# EAGLE design ultimate imu-v12 (EAGLE 5.06)

## Sheet 1 of 2
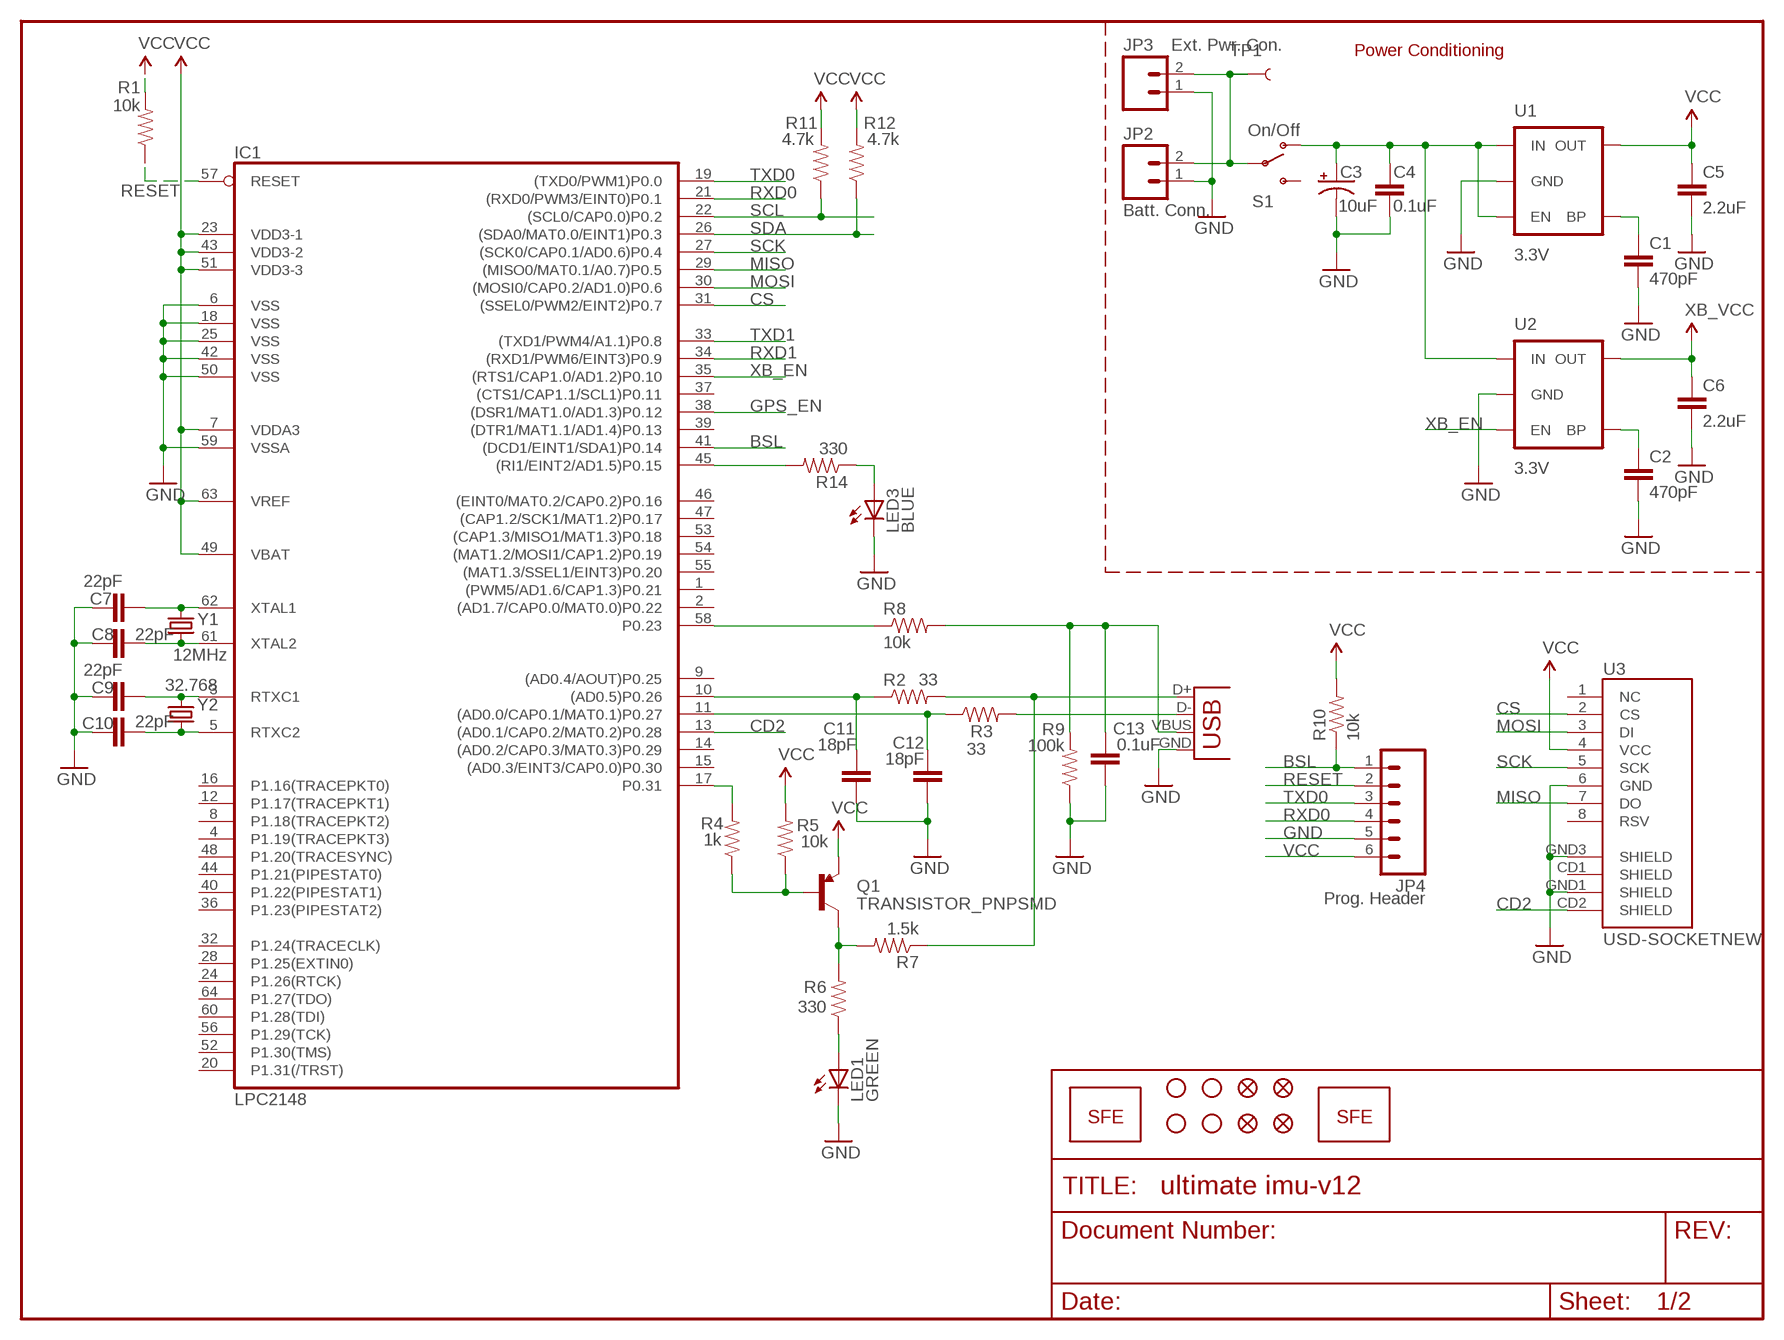
[diagram p0: schematic, sheet 1]

### Parts
C1  470pF  CAP0402-CAP  [0402-CAP]
C2  470pF  CAP0402-CAP  [0402-CAP]
C3  10uF  CAP_POL3528  [EIA3528]
C4  0.1uF  CAP0402-CAP  [0402-CAP]
C5  2.2uF  CAP0402-CAP  [0402-CAP]
C6  2.2uF  CAP0402-CAP  [0402-CAP]
C7  22pF  CAP0402-CAP  [0402-CAP]
C8  22pF  CAP0402-CAP  [0402-CAP]
C9  22pF  CAP0402-CAP  [0402-CAP]
C10  22pF  CAP0402-CAP  [0402-CAP]
C11  18pF  CAP0402-CAP  [0402-CAP]
C12  18pF  CAP0402-CAP  [0402-CAP]
C13  0.1uF  CAP0402-CAP  [0402-CAP]
IC1  LPC2148  LPC213X  [SQFP-S-10X10-64]
JP1  LOGO-SFENEW  [SFE-NEW-WEBLOGO]
JP2  Batt. Conn.  M02-JST-2MM-SMT  [JST-2-SMD]
JP3  Ext. Pwr. Con.  M02PTH  [1X02]
JP4  Prog. Header  M06SIP  [1X06]
JP6  STAND-OFF  [STAND-OFF]
JP7  STAND-OFF  [STAND-OFF]
JP8  STAND-OFF  [STAND-OFF]
JP9  STAND-OFF  [STAND-OFF]
JP10  FIDUCIAL1X2  [FIDUCIAL-1X2]
JP11  FIDUCIAL1X2  [FIDUCIAL-1X2]
JP12  LOGO-SFESK  [SFE-LOGO-FLAME]
JP13  FIDUCIAL1X2  [FIDUCIAL-1X2]
JP14  FIDUCIAL1X2  [FIDUCIAL-1X2]
LED1  GREEN  LED0603  [LED-0603]
LED3  BLUE  LED0603  [LED-0603]
Q1  TRANSISTOR_PNPSMD  [SOT23-3]
R1  10k  RESISTOR0402-RES  [0402-RES]
R2  33  RESISTOR0402-RES  [0402-RES]
R3  33  RESISTOR0402-RES  [0402-RES]
R4  1k  RESISTOR0402-RES  [0402-RES]
R5  10k  RESISTOR0402-RES  [0402-RES]
R6  330  RESISTOR0402-RES  [0402-RES]
R7  1.5k  RESISTOR0402-RES  [0402-RES]
R8  10k  RESISTOR0402-RES  [0402-RES]
R9  100k  RESISTOR0402-RES  [0402-RES]
R10  10k  RESISTOR0402-RES  [0402-RES]
R11  4.7k  RESISTOR0402-RES  [0402-RES]
R12  4.7k  RESISTOR0402-RES  [0402-RES]
R14  330  RESISTOR0402-RES  [0402-RES]
S1  On/Off  SWITCH-SPSTSMD  [AYZ0202]
TP1  TEST-POINT3X5  [PAD.03X.05]
U1  3.3V  V_REG_LDOSMD  [SOT23-5]
U2  3.3V  V_REG_LDOSMD  [SOT23-5]
U3  USD-SOCKETNEW  [MICRO-SD-SOCKET-PP]
X1  USBSMD  [USB-MINIB]
Y1  12MHz  CRYSTAL5X3  [CRYSTAL-SMD-5X3]
Y2  32.768  CRYSTAL32-SMD  [CRYSTAL-32KHZ-SMD]

### Nets
BSL: IC1.41((DCD1/EINT1/SDA1)P0.14) JP4.1 R10.1
CD2: IC1.13((AD0.1/CAP0.2/MAT0.2)P0.28) U3.CD2(SHIELD)
CS: IC1.31((SSEL0/PWM2/EINT2)P0.7) U3.2(CS)
GND: C1.2 C2.2 C3.C(-) C4.2 C5.2 C6.2 C7.1 C8.1 C9.1 C10.1 C11.1 C12.1 C13.1 IC1.6(VSS) IC1.18(VSS) IC1.25(VSS) IC1.42(VSS) IC1.50(VSS) IC1.59(VSSA) JP2.1 JP3.1 JP4.5 LED1.C LED3.C R9.1 U1.2(GND) U2.2(GND) U3.6(GND) U3.GND1(SHIELD) U3.GND3(SHIELD) X1.GND ; also sheet 2
GPS_EN: IC1.38((DSR1/MAT1.0/AD1.3)P0.12) ; also sheet 2
MISO: IC1.29((MISO0/MAT0.1/A0.7)P0.5) U3.7(DO)
MOSI: IC1.30((MOSI0/CAP0.2/AD1.0)P0.6) U3.3(DI)
N$4: C7.2 IC1.62(XTAL1) Y1.3
N$5: IC1.45((RI1/EINT2/AD1.5)P0.15) R14.2
N$6: C1.1 U1.4(BP)
N$7: C2.1 U2.4(BP)
N$8: C8.2 IC1.61(XTAL2) Y1.1
N$9: C9.2 IC1.3(RTXC1) Y2.X1
N$10: C10.2 IC1.5(RTXC2) Y2.X2
N$11: C11.2 IC1.10((AD0.5)P0.26) R2.1
N$12: R2.2 R7.1 X1.D+
N$13: R3.2 X1.D-
N$14: C12.2 IC1.11((AD0.0/CAP0.1/MAT0.1)P0.27) R3.1
N$15: IC1.17(P0.31) R4.2
N$16: Q1.1(B) R4.1 R5.1
N$17: LED3.A R14.1
N$19: Q1.3(C) R6.2 R7.2
N$20: LED1.A R6.1
N$21: IC1.58(P0.23) R8.1
N$22: C13.2 R8.2 R9.2 X1.VBUS
RESET: IC1.57(RESET) JP4.2 R1.1
RXD0: IC1.21((RXD0/PWM3/EINT0)P0.1) JP4.4 ; also sheet 2
RXD1: IC1.34((RXD1/PWM6/EINT3)P0.9) ; also sheet 2
SCK: IC1.27((SCK0/CAP0.1/AD0.6)P0.4) U3.5(SCK)
SCL: IC1.22((SCL0/CAP0.0)P0.2) R11.1 ; also sheet 2
SDA: IC1.26((SDA0/MAT0.0/EINT1)P0.3) R12.1 ; also sheet 2
TXD0: IC1.19((TXD0/PWM1)P0.0) JP4.3 ; also sheet 2
TXD1: IC1.33((TXD1/PWM4/A1.1)P0.8) ; also sheet 2
VBAT: JP2.2 JP3.2 S1.2(P) TP1.P$1
VCC: C5.1 IC1.7(VDDA3) IC1.23(VDD3-1) IC1.43(VDD3-2) IC1.49(VBAT) IC1.51(VDD3-3) IC1.63(VREF) JP4.6 Q1.2(E) R1.2 R5.2 R10.2 R11.2 R12.2 U1.5(OUT) U3.4(VCC) ; also sheet 2
VON: C3.A(+) C4.1 S1.1(O) U1.1(IN) U1.3(EN) U2.1(IN)
XB_EN: IC1.35((RTS1/CAP1.0/AD1.2)P0.10) U2.3(EN)
XB_VCC: C6.1 U2.5(OUT) ; also sheet 2
Unconnected: IC1.1((PWM5/AD1.6/CAP1.3)P0.21) IC1.2((AD1.7/CAP0.0/MAT0.0)P0.22) IC1.4(P1.19(TRACEPKT3)) IC1.8(P1.18(TRACEPKT2)) IC1.9((AD0.4/AOUT)P0.25) IC1.12(P1.17(TRACEPKT1)) IC1.14((AD0.2/CAP0.3/MAT0.3)P0.29) IC1.15((AD0.3/EINT3/CAP0.0)P0.30) IC1.16(P1.16(TRACEPKT0)) IC1.20(P1.31(/TRST)) IC1.24(P1.26(RTCK)) IC1.28(P1.25(EXTIN0)) IC1.32(P1.24(TRACECLK)) IC1.36(P1.23(PIPESTAT2)) IC1.37((CTS1/CAP1.1/SCL1)P0.11) IC1.39((DTR1/MAT1.1/AD1.4)P0.13) IC1.40(P1.22(PIPESTAT1)) IC1.44(P1.21(PIPESTAT0)) IC1.46((EINT0/MAT0.2/CAP0.2)P0.16) IC1.47((CAP1.2/SCK1/MAT1.2)P0.17) IC1.48(P1.20(TRACESYNC)) IC1.52(P1.30(TMS)) IC1.53((CAP1.3/MISO1/MAT1.3)P0.18) IC1.54((MAT1.2/MOSI1/CAP1.2)P0.19) IC1.55((MAT1.3/SSEL1/EINT3)P0.20) IC1.56(P1.29(TCK)) IC1.60(P1.28(TDI)) IC1.64(P1.27(TDO)) S1.3(S) U3.1(NC) U3.8(RSV) U3.CD1(SHIELD)

### Notes on the sheet
- Power Conditioning

## Sheet 2 of 2
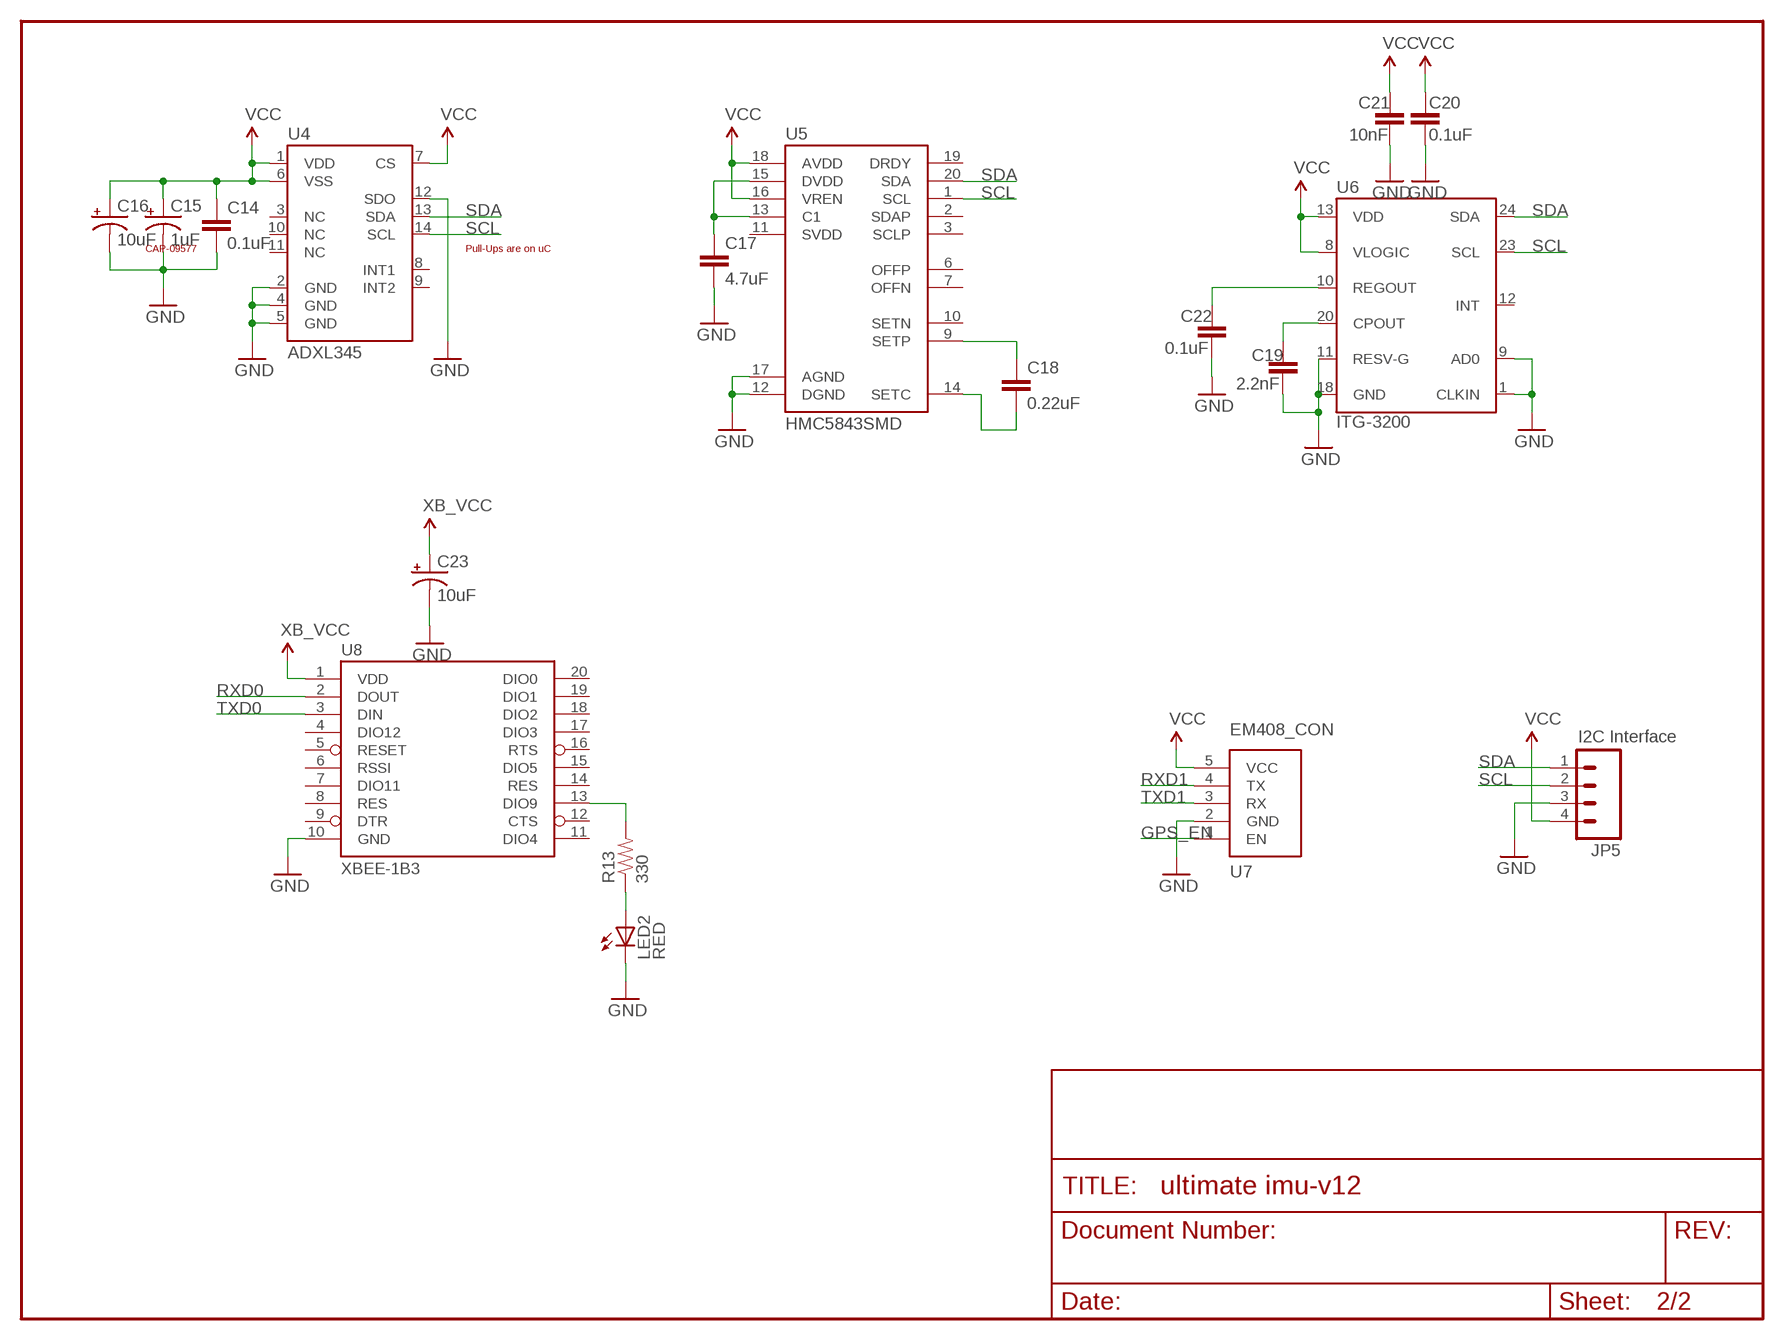
[diagram p1: schematic, sheet 2]

### Parts
C14  0.1uF  CAP0402-CAP  [0402-CAP]
C15  1uF  CAP_POLC  [PANASONIC_C]
C16  10uF  CAP_POL3528  [EIA3528]
C17  4.7uF  CAP0402-CAP  [0402-CAP]
C18  0.22uF  CAP0402-CAP  [0402-CAP]
C19  2.2nF  CAP0402-CAP  [0402-CAP]
C20  0.1uF  CAP0402-CAP  [0402-CAP]
C21  10nF  CAP0402-CAP  [0402-CAP]
C22  0.1uF  CAP0402-CAP  [0402-CAP]
C23  10uF  CAP_POL1206  [EIA3216]
JP5  I2C Interface  M04PTH  [1X04]
LED2  RED  LED0603  [LED-0603]
R13  330  RESISTOR0402-RES  [0402-RES]
U4  ADXL345  [LGA14]
U5  HMC5843SMD  [LPCC20]
U6  ITG-3200  [QFN-24]
U7  EM408_CON  [EM408_CON]
U8  XBEE-1B3  [XBEE-SMD]

### Nets
GND: C14.2 C15.- C16.C(-) C17.2 C19.2 C20.2 C21.2 C22.2 C23.C(-) JP5.3 LED2.C U4.2(GND) U4.4(GND) U4.5(GND) U4.12(SDO) U5.12(DGND) U5.17(AGND) U6.1(CLKIN) U6.9(AD0) U6.11(RESV-G) U6.18(GND) U7.2(GND) U8.10(GND) ; also sheet 1
GPS_EN: U7.1(EN) ; also sheet 1
N$1: C19.1 U6.20(CPOUT)
N$2: C18.2 U5.14(SETC)
N$3: C18.1 U5.9(SETP)
N$24: C17.1 U5.13(C1) U5.15(DVDD)
N$25: LED2.A R13.1
N$26: C22.1 U6.10(REGOUT)
N$28: R13.2 U8.13(DIO9)
RXD0: U8.2(DOUT) ; also sheet 1
RXD1: U7.4(TX) ; also sheet 1
SCL: JP5.2 U4.14(SCL) U5.1(SCL) U6.23(SCL) ; also sheet 1
SDA: JP5.1 U4.13(SDA) U5.20(SDA) U6.24(SDA) ; also sheet 1
TXD0: U8.3(DIN) ; also sheet 1
TXD1: U7.3(RX) ; also sheet 1
VCC: C14.1 C15.+ C16.A(+) C20.1 C21.1 JP5.4 U4.1(VDD) U4.6(VSS) U4.7(CS) U5.16(VREN) U5.18(AVDD) U6.8(VLOGIC) U6.13(VDD) U7.5(VCC) ; also sheet 1
XB_VCC: C23.A(+) U8.1(VDD) ; also sheet 1
Unconnected: U4.3(NC) U4.8(INT1) U4.9(INT2) U4.10(NC) U4.11(NC) U5.2(SDAP) U5.3(SCLP) U5.6(OFFP) U5.7(OFFN) U5.10(SETN) U5.11(SVDD) U5.19(DRDY) U6.12(INT) U8.4(DIO12) U8.5(RESET) U8.6(RSSI) U8.7(DIO11) U8.8(RES) U8.9(DTR) U8.11(DIO4) U8.12(CTS) U8.14(RES) U8.15(DIO5) U8.16(RTS) U8.17(DIO3) U8.18(DIO2) U8.19(DIO1) U8.20(DIO0)

### Notes on the sheet
- CAP-09577 | Pull-Ups are on uC

## Library data of the parts
C1 C2 C4-C14 C17-C22 = SparkFun:CAP: Capacitor Standard 0603 ceramic capacitor, and 0.1" leaded capacitor.
C3 C15 C16 C23 = SparkFun:CAP_POL: Capacitor Polarized These are standard SMD and PTH capacitors. Normally 10uF, 47uF, and 100uF in electrolytic and tantalum varieties. Always verify the external diameter of the through hole cap, it varies with capacity, voltage, and manufacturer. The EIA devices should be standard.
IC1 = SparkFun:LPC213X: LPC213x Schematic element and footprint for NXP LPC213x. Spark Fun Electronics SKU : COM-00520
JP1 JP12 = SparkFun:LOGO-SFE: Spark Fun Electronics PCB Logo This is the standard Spark Fun Electronics PCB logo.
JP2 JP3 = SparkFun:M02: Header 2 Standard 2-pin 0.1" header. Use with straight break away headers (SKU : PRT-00116), right angle break away headers (PRT-00553), swiss pins (PRT-00743), machine pins (PRT-00117), and female headers (PRT-00115). Molex polarized connector foot print use with SKU : PRT-08233 with associated crimp pins and housings.
JP4 = SparkFun:M06: Header 6 Standard 6-pin 0.1" header. Use with straight break away headers (SKU : PRT-00116), right angle break away headers (PRT-00553), swiss pins (PRT-00743), machine pins (PRT-00117), and female headers (PRT-00115). Molex polarized connector foot print use with SKU : PRT-08094 with associated crimp pins and housings. NOTES ON THE VARIANTS LOCK and LOCK_LONGPADS... This footprint was designed to help hold the alignment of a through-hole component (i.e. 6-pin header) while soldering it into place. You may notice that each hole has been shifted either up or down by 0.005 of an inch from it's more standard position (which is a perfectly straight line). This slight alteration caused the pins (the squares in the middle) to touch the edges of the holes. Because they are alternating, it causes a "brace" to hold the component in place. 0.005 has proven to be the perfect amount of "off-center" position when using our standard breakaway headers. Although looks a little odd when you look at the bare footprint, once you have a header in there, the alteration is very hard to notice. Also, if you push a header all the way into place, it is covered up entirely on the bottom side. This idea of altering the position of holes to aid alignment will be further integrated into the Sparkfun Library for other footprints. It can help hold any component with 3 or more connection pins.
JP5 = SparkFun:M04: Header 4 Standard 4-pin 0.1" header. Use with straight break away headers (SKU : PRT-00116), right angle break away headers (PRT-00553), swiss pins (PRT-00743), machine pins (PRT-00117), and female headers (PRT-00115). Molex polarized connector foot print use with SKU : PRT-08231 with associated crimp pins and housings.
JP6-JP9 = SparkFun:STAND-OFF: Stand Off This is the mechanical footprint for a #4 phillips button head screw. Use the keepout ring to avoid running the screw head into surrounding components. SKU : PRT-00447
JP10 JP11 JP13 JP14 = SparkFun:FIDUCIAL: Fiducial Alignment Points Various fiducial points for machine vision alignment.
LED1-LED3 = SparkFun:LED: LEDs Standard schematic elements and footprints for 5mm, 3mm, 1206, and 0603 sized LEDs. 5mm - Spark Fun Electronics SKU : COM-00529 (and others)
Q1 = SparkFun:TRANSISTOR_PNP
R1-R14 = SparkFun:RESISTOR: Resistor Basic schematic elements and footprints for 0603, 1206, and PTH resistors.
S1 = SparkFun:SWITCH-SPST: SPST Switch Simple slide switch. Spark Fun Electronics SKU : COM-00102
TP1 = SparkFun:TEST-POINT
U1 U2 = SparkFun:V_REG_LDO: Voltage Regulator LDO Standard 150mA LDO voltage regulator in SOT-23 layout. Micrel part MIC5205. BP (by-pass) pin is used to lower output noise with 470pF cap.
U3 = SparkFun:USD-SOCKET: microSD Socket Push-push type uSD socket. Schematic element and footprint production proven. Spark Fun Electronics SKU : PRT-00127. tDoc lines correctly indicate media card edge positions when inserting (unlocked, locked, depressed).
U4 = SparkFun:ADXL345
U5 = SparkFun:HMC5843
U6 = SparkFun:ITG-3200: ITG-3200 3-axis gyro, digital output, qfn24 package
U7 = SparkFun:EM408_CON: This is the mating connector for the EM408 GPS receiver. The EM408 connects to the board via a cable, this connector footprint does not include the outline of the receiver. You should include the "EM408_Outline" device in your schematic if you are to use the EM408 in your design.
U8 = SparkFun:XBEE-1
X1 = SparkFun:USB: USB Connectors USB-B-PTH is fully proven SKU : PRT-00139 USB-miniB is fully proven SKU : PRT-00587 USB-A-PCB is untested. USB-A-H is throughly reviewed, but untested. Spark Fun Electronics SKU : PRT-00437 USB-B-SMT is throughly reviewed, but untested. Needs silkscreen touching up. USB-A-S has not been used/tested USB-MB-H has not been used/tested
Y1 Y2 = SparkFun:CRYSTAL: Crystals Various standard crystals. Proven footprints. Spark Fun Electronics SKU : COM-00534

## Board
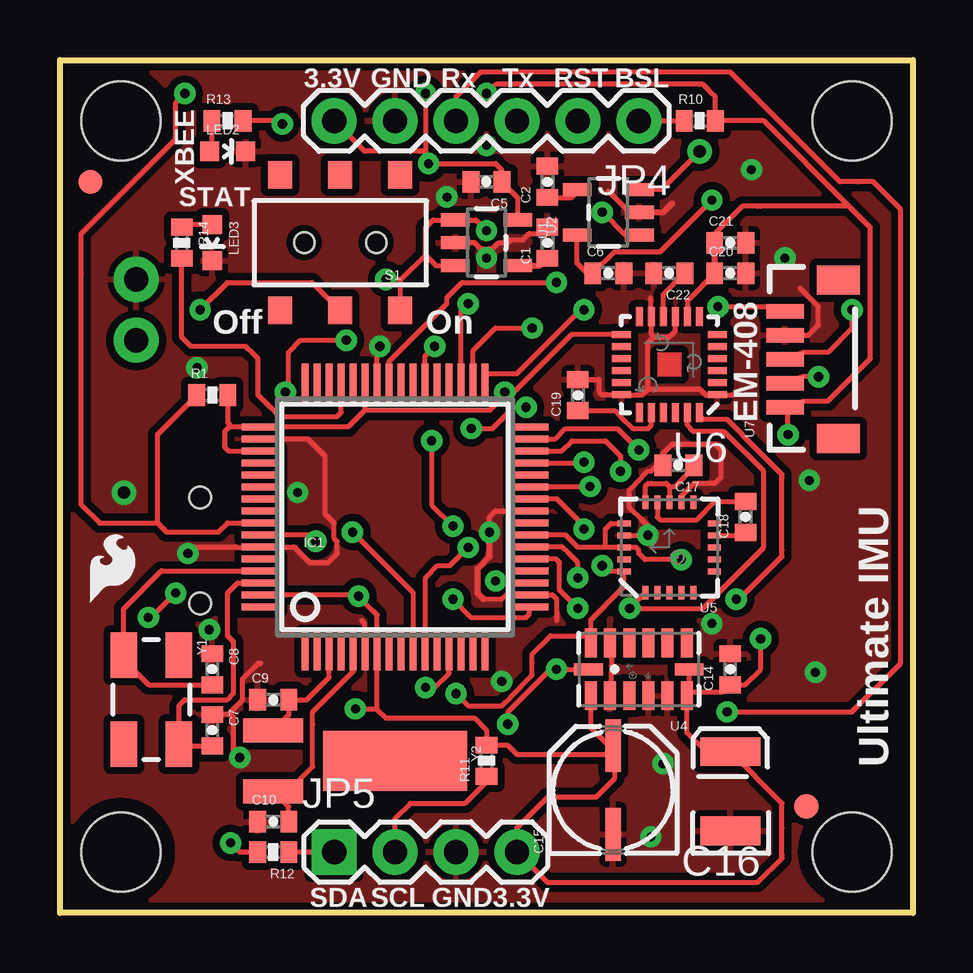
[diagram p2: board, top side]
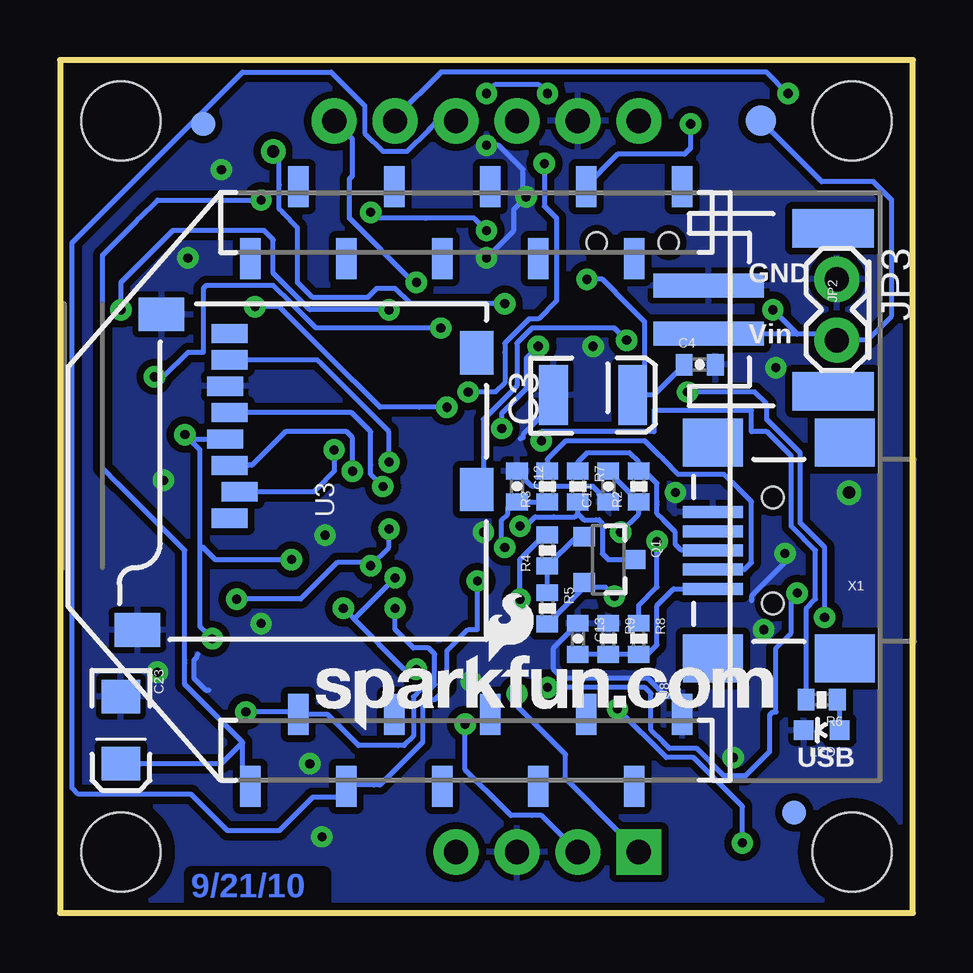
[diagram p3: board, bottom side, seen from below]

Size 35.56 x 35.56 mm. Coordinates in mm from the lower left corner, seen from the top.
Outline: 0,0 0,35.56 35.56,35.56 35.56,0 0,0
Copper layers (1*16): Top 0.035mm / dielectric 1.5mm / Bottom 0.035mm
Design rules "SparkFun *": minimum track width 8mil, minimum drill 15mil, track to track 6mil, track to pad 6mil, pad to pad 6mil, via to via 6mil, smd to smd 6mil, copper to edge 8mil, drill to drill 8mil, minimum pad ring 12mil, minimum via ring 10mil, stop-mask expansion 4mil, vias tented up to drill 20mil, thermal gap 10mil

### Footprints (pad centres in the part's own frame; a part is rotated, then mirrored left to right if it is on the bottom)
0402-CAP = smd 0.7 x 0.9: 1 -0.65,0; 2 0.65,0
EIA3528 = smd 1.2 x 2.5: A 1.65,0; C -1.65,0
PANASONIC_C = smd 2.2 x 0.65: + 1.9,-0.2; - -1.8,-0.2
EIA3216 = smd 1.4 x 1.6: A 1.4,0; C -1.4,0
SQFP-S-10X10-64 = smd 0.3 x 1.6: 1 -3.75,-5.6; 2 -3.25,-5.6; 3 -2.75,-5.6; 4 -2.25,-5.6; 5 -1.75,-5.6; 6 -1.25,-5.6; 7 -0.75,-5.6; 8 -0.25,-5.6; 9 0.25,-5.6; 10 0.75,-5.6; 11 1.25,-5.6; 12 1.75,-5.6; 13 2.25,-5.6; 14 2.75,-5.6; 15 3.25,-5.6; 16 3.75,-5.6; 33 3.75,5.6; 34 3.25,5.6; 35 2.75,5.6; 36 2.25,5.6; 37 1.75,5.6; 38 1.25,5.6; 39 0.75,5.6; 40 0.25,5.6; 41 -0.25,5.6; 42 -0.75,5.6; 43 -1.25,5.6; 44 -1.75,5.6; 45 -2.25,5.6; 46 -2.75,5.6; 47 -3.25,5.6; 48 -3.75,5.6 | smd 1.6 x 0.3: 17 5.6,-3.75; 18 5.6,-3.25; 19 5.6,-2.75; 20 5.6,-2.25; 21 5.6,-1.75; 22 5.6,-1.25; 23 5.6,-0.75; 24 5.6,-0.25; 25 5.6,0.25; 26 5.6,0.75; 27 5.6,1.25; 28 5.6,1.75; 29 5.6,2.25; 30 5.6,2.75; 31 5.6,3.25; 32 5.6,3.75; 49 -5.6,3.75; 50 -5.6,3.25; 51 -5.6,2.75; 52 -5.6,2.25; 53 -5.6,1.75; 54 -5.6,1.25; 55 -5.6,0.75; 56 -5.6,0.25; 57 -5.6,-0.25; 58 -5.6,-0.75; 59 -5.6,-1.25; 60 -5.6,-1.75; 61 -5.6,-2.25; 62 -5.6,-2.75; 63 -5.6,-3.25; 64 -5.6,-3.75
JST-2-SMD = smd 1 x 4.6: 1 -1,-3.7; 2 1,-3.7 | smd 1.6 x 3.4: NC1 -3.4,1.5; NC2 3.4,1.5
1X02 = drill 1.016 pad 1.88 round: 1 0,0; 2 2.54,0
1X06 = drill 1.016 pad 1.88 round: 1 0,0; 2 2.54,0; 3 5.08,0; 4 7.62,0; 5 10.16,0; 6 12.7,0
1X04 = drill 1.016 pad 1.88 square: 1 0,0 | drill 1.016 pad 1.88 round: 2 2.54,0; 3 5.08,0; 4 7.62,0
STAND-OFF = hole 3.302: 0,0
FIDUCIAL-1X2 = smd 1 x 1: 1 0,0
LED-0603 = smd 0.8 x 0.8: A 0,-0.75; C 0,0.75
SOT23-3 = smd 0.8 x 0.9: 1 -0.95,-1; 2 0.95,-1; 3 0,1.1
0402-RES = smd 0.7 x 0.9: 1 -0.65,0; 2 0.65,0
AYZ0202 = smd 1 x 1.15: 1 -2.5,2.825; 2 0,2.825; 3 2.5,2.825; 4 -2.5,-2.825; 5 0,-2.825; 6 2.5,-2.825 | hole 0.85: 1.5,0; -1.5,0
PAD.03X.05 = smd 1.27 x 1.27: P$1 0,0
SOT23-5 = smd 0.55 x 1.2: 1 -0.95,-1.3; 2 0,-1.3; 3 0.95,-1.3; 4 0.95,1.3; 5 -0.95,1.3
MICRO-SD-SOCKET-PP = smd 0.8 x 1.5: 1 -8.94,10.7; 2 -7.84,10.3; 3 -6.74,10.7; 4 -5.64,10.9; 5 -4.54,10.7; 6 -3.44,10.9; 7 -2.34,10.7; 8 -1.24,10.7 | smd 1.8 x 1.4: CD1 -2.05,0.4; CD2 -7.75,0.4 | smd 1.4 x 1.9: GND1 -13.6,14.55; GND3 -0.45,13.55
LGA14 = smd 0.5 x 1.2: 1 2,1.1; 2 1.2,1.1; 3 0.4,1.1; 4 -0.4,1.1; 5 -1.2,1.1; 6 -2,1.1; 8 -2,-1.1; 9 -1.2,-1.1; 10 -0.4,-1.1; 11 0.4,-1.1; 12 1.2,-1.1; 13 2,-1.1 | smd 1.2 x 0.5: 7 -2.1,0; 14 2.1,0
LPCC20 = smd 0.25 x 0.56: 1 1,1.88; 2 0.5,1.88; 3 0,1.88; 4 -0.5,1.88; 5 -1,1.88; 11 -1,-1.88; 12 -0.5,-1.88; 13 0,-1.88; 14 0.5,-1.88; 15 1,-1.88 | smd 0.56 x 0.25: 6 -1.88,1; 7 -1.88,0.5; 8 -1.88,0; 9 -1.88,-0.5; 10 -1.88,-1; 16 1.88,-1; 17 1.88,-0.5; 18 1.88,0; 19 1.88,0.5; 20 1.88,1
QFN-24 = smd 0.8 x 0.3: 1 -2,1.25; 2 -2,0.75; 3 -2,0.25; 4 -2,-0.25; 5 -2,-0.75; 6 -2,-1.25; 13 2,-1.25; 14 2,-0.75; 15 2,-0.25; 16 2,0.25; 17 2,0.75; 18 2,1.25 | smd 0.3 x 0.8: 7 -1.25,-2; 8 -0.75,-2; 9 -0.25,-2; 10 0.25,-2; 11 0.75,-2; 12 1.25,-2; 19 1.25,2; 20 0.75,2; 21 0.25,2; 22 -0.25,2; 23 -0.75,2; 24 -1.25,2
EM408_CON = smd 0.6 x 1.55: 1 4,0; 2 3,0; 3 2,0; 4 1,0; 5 0,0 | smd 1.2 x 1.8: P$1 -1.3,-2.225; P$2 5.3,-2.225
XBEE-SMD = smd 1.7 x 0.85: 1 -12.5,20; 2 -9.5,18; 3 -12.5,16; 4 -9.5,14; 5 -12.5,12; 6 -9.5,10; 7 -12.5,8; 8 -9.5,6; 9 -12.5,4; 10 -9.5,2; 11 12.5,2; 12 9.5,4; 13 12.5,6; 14 9.5,8; 15 12.5,10; 16 9.5,12; 17 12.5,14; 18 9.5,16; 19 12.5,18; 20 9.5,20
USB-MINIB = smd 2.5 x 0.5: D+ 2.5,0; D- 2.5,0.8; GND 2.5,-1.6; ID 2.5,-0.8; VBUS 2.5,1.6 | smd 2.5 x 2: MTN1 -3,4.5; MTN2 2.5,4.5; MTN3 -3,-4.5; MTN4 2.5,-4.5 | hole 0.9: 0,2.2; 0,-2.2
CRYSTAL-SMD-5X3 = smd 1.9 x 1.1: 1 -1.85,-1.15; 2 1.85,-1.15; 3 1.85,1.15; 4 -1.85,1.15
CRYSTAL-32KHZ-SMD = smd 2.5 x 6: SHEILD 0,5.08 | smd 1 x 2.5: X1 -1.27,0; X2 1.27,0

### Placement (x,y rotation side)
C1  20.32,27.94 90 top
C2  20.32,30.48 90 top
C3  13.34,21.59 0 bottom
C4  8.89,22.86 0 bottom
C5  17.78,30.48 180 top
C6  22.86,26.67 0 top
C7  6.35,7.62 270 top
C8  6.35,10.16 270 top
C9  8.89,8.89 0 top
C10  8.89,3.81 0 top
C11  12.7,17.78 90 bottom
C12  16.51,17.78 270 bottom
C13  13.97,11.43 270 bottom
C14  27.94,10.16 90 top
C15  22.86,5.08 90 top
C16  27.94,5.08 90 top
C17  25.78,18.67 180 top
C18  28.57,16.51 90 top
C19  21.59,21.59 90 top
C20  27.94,26.67 0 top
C21  27.94,27.94 0 top
C22  25.4,26.67 180 top
C23  33.02,7.62 270 bottom
IC1  13.97,16.51 0 top
JP1  24.89,7.62 0 bottom
JP2  4.83,25.15 270 bottom
JP3  3.17,26.42 270 bottom
JP4  24.13,33.02 180 top
JP5  11.43,2.54 0 top
JP6  2.54,2.54 90 top
JP7  2.54,33.02 90 top
JP8  33.02,33.02 90 top
JP9  33.02,2.54 90 top
JP10  31.11,4.45 90 top
JP11  1.27,30.48 90 top
JP12  1.27,12.95 0 top
JP13  29.59,32.89 0 bottom
JP14  4.95,4.19 0 bottom
LED1  3.81,7.62 90 bottom
LED2  6.99,31.75 270 top
LED3  6.35,27.94 180 top
Q1  12.7,14.73 270 bottom
R1  6.35,21.59 0 top
R2  11.43,17.78 90 bottom
R3  15.24,17.78 90 bottom
R4  15.24,15.11 90 bottom
R5  15.24,12.7 270 bottom
R6  3.81,8.89 180 bottom
R7  13.97,17.78 270 bottom
R8  11.43,11.43 270 bottom
R9  12.7,11.43 270 bottom
R10  26.67,33.02 0 top
R11  17.78,6.35 90 top
R12  8.89,2.54 180 top
R13  6.99,33.02 0 top
R14  5.08,27.94 270 top
S1  11.68,27.94 180 top
TP1  6.35,33.02 0 bottom
U1  17.78,27.94 270 top
U2  22.86,29.21 90 top
U3  17.78,25.4 90 bottom
U4  24.13,10.16 180 top
U5  25.4,15.24 180 top
U6  25.4,22.86 180 top
U7  30.23,21.08 90 top
U8  7.62,17.78 90 bottom
X1  5.84,15.11 180 bottom
Y1  3.81,8.89 270 top
Y2  8.89,6.35 270 top

### Tracks (layer width: path | path; a pad name or v marks a point on that pad's centre or on a via)
BSL  (via drill 0.38)
  Top 0.203: IC1.41 13.72,22.86 13.72,22.99 16.13,25.4 16.13,25.53 16.13,25.65 16.76,26.29 v20.7,26.29 | R10.1 25.91,33.02 JP4.1
  Top 0.254: 25.91,33.02 R10.1
  Bottom 0.203: v20.7,26.29 20.83,26.29 23.5,28.96 23.5,30.61 23.37,30.73 23.37,32.26 JP4.1
CD2  (via drill 0.38)
  Top 0.203: v4.83,13.34 3.81,12.32 v3.68,12.32 | v9.4,21.72 9.53,21.84 9.53,22.23 9.53,23.37 10.03,23.88 11.68,23.88 v11.94,23.88 | v15.24,9.4 15.62,9.4 16.22,10 IC1.13
  Bottom 0.203: v15.24,9.4 11.18,9.4 10.92,9.14 10.92,7.62 10.41,7.11 10.16,6.86 9.02,6.86 7.87,5.71 6.99,5.71 5.97,6.73 5.97,8.26 5.84,8.38 5.71,8.38 5.71,11.05 5.08,11.68 5.08,13.34 v4.83,13.34 | v3.68,12.32 3.68,15.24 4.45,16 4.7,16.26 4.7,18.41 4.7,19.18 5.33,19.81 5.46,19.94 6.1,20.57 6.1,21.08 6.1,21.21 6.6,21.72 v9.4,21.72 | U3.CD2 17.91,18.54 17.91,20.57 16.51,21.97 16.51,23.75 15.88,24.38 15.37,24.38 12.45,24.38 v11.94,23.88
CS  (via drill 0.38)
  Top 0.203: IC1.31 20.65,19.76 21.08,20.19 21.34,20.19 23.24,20.19 v24.13,19.3
  Bottom 0.203: U3.2 25.56,17.56 24.98,17.56 24.89,17.65 24.13,18.41 v24.13,19.3
GND  (via drill 0.38, 0.51)
  Top 0.203: IC1.6 12.7,11.68 12.7,12.06 12.57,12.19 | U4.2 22.99,9.65 22.99,10.03 23.06,10.04 | 23.06,10.28 22.99,10.29 22.99,10.67 U4.12 | 24.62,25.64 24.64,25.53 24.64,25.15 U6.11 24.65,24.12 24.77,24 | 17.78,27.69 17.53,27.69 17.27,27.94 17.02,27.94 U1.2 | 17.78,27.69 18.03,27.69 18.29,27.94 18.67,27.94 18.8,28.07 19.3,28.07 19.56,28.32 19.94,28.32 C1.2 | 28.06,21.61 27.94,21.59 27.69,21.59 U6.1 27.05,21.59 26.92,21.59 26.67,21.84 24.51,21.84 | 29.55,19.59 29.59,19.56 29.62,19.44 | 17.78,27.69 v17.78,27.3 | 24.51,21.84 24.26,21.59 23.75,21.59 U6.18 22.59,21.61 22.48,21.72 22.48,22.23 22.46,22.24 C19.2 | U5.17 v24.5,15.74 v24.51,15.75 24.51,16.13 24.26,16.38 23.75,16.89 23.75,17.4 23.75,17.65 24,17.91 24.51,18.41 24.64,18.41 25.15,18.92 25.15,19.18 25.53,19.56 27.3,19.56 27.56,19.3 27.56,18.16 27.3,17.91 26.42,17.91 25.9,17.39 U5.12 | v5.33,14.99 5.61,15.26 7.31,15.26 7.37,15.24 7.62,15.24 IC1.59 9.76,15.26 10.41,14.61 11.18,14.61 11.56,14.99 11.56,15.49 11.43,15.62 11.43,16.26 11.05,16.64 11.05,18.92 11.05,19.05 10.34,19.76 IC1.50 | U6.9 25.65,24.25 25.4,24 25.15,24 24.77,24 | 24.51,21.84 24.51,23.75 24.77,24 | IC1.42 13.22,23.51 v13.34,23.62 | 20.7,12.19 20.7,13.08 20.52,13.26 19.61,13.26 19.56,13.21 19.57,13.22 IC1.18 18.59,13.26 18.41,13.08 17.65,13.08 | U7.2 31.19,24.08 31.62,24.51 31.62,25.27 30.86,26.04 | IC1.25 18.16,16.76 17.91,16.51 17.91,16 v17.91,15.88 | 7.1,8.27 C7.1 | 7.1,8.27 7.24,8.13 7.24,6.73 v7.49,6.48 | 8.38,10.41 8.26,10.41 7.62,9.78 7.62,8.89 7.49,8.76 7.1,8.37 7.1,8.27 | 24.13,29.21 23.75,29.21 22.86,30.1
  Top 0.254: U2.2 25.15,29.21 25.53,29.59 | 17.65,13.08 17.4,13.34 17.4,14.35 17.91,14.86 v17.91,15.88
  Bottom 0.203: U8.10 10.03,9.02 10.29,9.02 11.05,9.78 14.61,9.78 14.99,10.16 14.99,11.05 14.22,11.81 C13.1 | v5.33,14.99 5.33,14.61 6.73,13.21 6.73,13.08 6.72,13.02 | C11.1 13.08,17.4 13.08,17.53 13.34,17.78 15.88,17.78 16.26,18.16 C12.1 | 16.37,19.77 16.26,19.81 16.26,19.94 15.49,20.7 C3.C | v17.78,27.3 16.64,28.45 16.64,29.34 v16.13,29.84 16.26,30.23 16.26,30.99 17.27,32 v17.78,32 | 29.36,9.28 29.46,9.27 29.97,9.78 29.97,10.54 29.84,10.67 29.82,10.79
  other vias: 6.22,11.81 27.18,12.06 25.15,6.22 31.5,10.03 28.83,30.99 5.71,22.73 31.24,18.03 30.23,27.3 18.41,9.65 9.91,17.53 24.64,3.17 2.67,17.53
  pour Top (isolate 0.305): 0,0 0,35.56 35.56,35.56 35.56,0
  pour Bottom (isolate 0.305): 0,0 0,35.56 35.56,35.56 35.56,0
GPS_EN  (via drill 0.38)
  Top 0.203: v27.43,25.27 29.46,25.27 U7.1 | v19.43,21.08 18.92,21.08 18.29,20.45 18.03,20.19 v17.14,20.19 | IC1.38 15.22,23.22 v15.62,23.62
  Bottom 0.203: v19.43,21.08 20.57,21.08 22.23,21.08 24.38,23.24 26.42,25.27 27.3,25.27 v27.43,25.27 | v17.14,20.19 17.14,20.83 16.51,21.46 16.13,21.84 16.13,22.35 16.13,23.11 v15.62,23.62
MISO  (via drill 0.38)
  Top 0.203: IC1.29 21.81,18.76 v21.84,18.8
  Bottom 0.203: U3.7 27.12,23.06 24.84,23.06 24.64,22.86 21.84,20.07 v21.84,18.8
MOSI  (via drill 0.38)
  Top 0.203: IC1.30 20.91,19.26 21.34,19.68 22.73,19.68 23.37,19.05 v23.37,18.41
  Bottom 0.203: U3.3 27.7,18.66 27.69,18.67 27.56,18.67 26.16,20.07 23.62,20.07 23.37,19.81 v23.37,18.41
N$1
  Top 0.203: U6.20 24.65,20.33 24.51,20.19 23.88,20.19 23.37,20.7 23.13,20.94 C19.1
N$2
  Top 0.203: U5.14 24.9,16.5 25.02,16.38 26.54,16.38 27.3,17.14 27.32,17.16 C18.2
N$3
  Top 0.203: C18.1 28.57,15.88 28.44,15.74 U5.9
N$4
  Top 0.203: IC1.62 7.41,13.76 6.99,13.34 6.99,11.56 7.24,11.3 7.24,9.14 6.99,8.89 5.21,8.89 5.08,8.76 4.96,8.64 Y1.3 5.03,7.04 5.08,6.99 5.09,6.97 C7.2 6.35,6.99
N$5
  Top 0.203: IC1.45 11.72,20.86 11.56,20.7 9.14,20.7 8.76,21.08 8.26,21.59 8.26,22.86 8.26,23.11 8.13,23.24 8,23.37 7.87,23.5 7.75,23.62 5.46,23.62 5.08,24 R14.2
N$6
  Top 0.254: C1.1 20.32,27.3 20,26.99 U1.4
N$7
  Top 0.203: C2.1 21.32,29.83 21.59,30.1
  Top 0.254: 21.59,30.1 21.56,30.13 U2.4
N$8
  Top 0.203: C8.2 3.7,9.51 3.56,9.65 3.43,9.78 2.66,10.55 Y1.1 2.66,12.69 2.67,12.7 4.23,14.26 IC1.61
N$9
  Top 0.203: IC1.3 11.22,9.82 10.79,9.4 10.67,9.27 10.29,8.89 C9.2 9.54,8.27 9.53,8.26 Y2.X1
N$10
  Top 0.203: IC1.5 12.22,10.06 10.54,8.38 10.54,7.87 10.54,6.1 9.53,5.08 Y2.X2 9.02,4.95 9.54,4.43 C10.2
N$11  (via drill 0.38)
  Top 0.203: IC1.10 14.73,11.68 14.73,13.34 v12.19,15.88
  Bottom 0.203: C11.2 12.7,18.41 12.7,18.4 R2.1 | R2.1 11.68,16.89 | R2.1 11.43,17.14 11.43,16.64 v12.19,15.88
N$12
  Bottom 0.203: R7.1 13.97,18.8 13.59,19.18 11.94,19.18 11.81,19.18 11.43,18.8 R2.2 11.19,18.43 10.67,17.91 10.67,17.14 10.67,17.02 10.67,16.64 10.41,16.38 9.91,15.88 9.91,15.37 9.78,15.24 9.65,15.11 X1.D+
N$13
  Bottom 0.203: X1.D- 7.02,14.31 6.73,14.61 6.73,17.14 7.24,17.65 7.87,18.29 8.13,18.29 9.78,18.29 10.41,18.92 10.54,19.05 10.67,19.18 11.18,19.68 12.06,19.68 14.48,19.68 14.99,19.18 15.24,18.92 R3.2
N$14  (via drill 0.38)
  Top 0.203: v17.02,15.24 16.26,14.48 15.75,14.48 15.24,13.97 15.24,11.68 IC1.11
  Bottom 0.203: R3.1 16.5,17.13 16.51,17.14 C12.2 16.89,16.89 16.89,16.64 17.14,16.38 17.14,15.37 v17.02,15.24
N$15  (via drill 0.38)
  Top 0.203: IC1.17 19.57,12.46 19.43,12.32 17.14,12.32 v16.38,13.08
  Bottom 0.203: R4.2 15.35,15.76 15.37,15.75 16.38,14.73 v16.38,13.08
N$16
  Bottom 0.203: Q1.1 14.04,15.68 15.24,14.48 R4.1 15.24,13.46 R5.1
N$17
  Top 0.203: R14.1 5.08,28.57 5.2,28.69 LED3.A
N$19  (via drill 0.38)
  Top 0.203: v15.49,19.68 15.49,17.02 v16.38,16.13
  Bottom 0.203: v15.49,19.68 15.49,20.07 10.79,20.07 10.79,20.95 6.73,20.95 6.73,20.07 6.1,20.07 5.08,19.05 5.08,16.13 4.06,15.11 4.06,13.08 4.45,12.7 4.45,9.27 R6.2 | v16.38,16.13 16.13,16.13 15.75,16.51 14.99,16.51 14.1,16.51 13.97,16.64 | Q1.3 12.7,14.73 12.95,14.99 12.95,16.13 12.95,16.26 13.08,16.38 13.21,16.38 13.72,16.38 13.97,16.64 | 13.97,16.64 R7.2
N$20
  Bottom 0.203: R6.1 3.17,8.89 3.06,8.78 LED1.A
N$21  (via drill 0.38)
  Top 0.203: IC1.58 10.4,15.76 v10.67,15.49
  Bottom 0.203: v10.67,15.49 10.67,13.59 11.43,12.83 11.43,12.19 R8.1
N$22
  Bottom 0.203: 11.3,10.79 11.32,10.78 R8.2 | 8.59,13.51 X1.VBUS 9.98,13.51 10.03,13.46 10.54,12.95 10.67,12.83 10.67,11.18 10.79,11.05 11.05,10.79 11.06,10.78 R8.2 | R8.2 12.69,10.78 12.7,10.79 R9.2 13.96,10.78 13.97,10.79 C13.2
N$24
  Top 0.203: U5.15 24.4,17.8 24.51,17.91 24.64,17.91 25.27,17.91 25.4,17.78 | 25.4,17.78 U5.13 | C17.1 26.43,18.56 26.42,18.54 25.65,17.78 25.4,17.78
N$25
  Top 0.203: LED2.A 6.22,31.75 6.33,31.86 R13.1
N$26
  Top 0.203: C22.1 26.04,26.67 25.15,25.79 U6.10
N$28  (via drill 0.38)
  Top 0.203: R13.2 9.14,33.02 v9.27,32.89
  Bottom 0.203: v9.27,32.89 9.27,31.88 9.53,31.62 12.32,31.62 13.72,30.23 13.66,30.28 U8.13
RESET  (via drill 0.38)
  Top 0.203: IC1.57 6.99,16.26 6.6,15.88 4.45,15.88 4.06,16.26 | 4.06,16.26 4.06,19.94 5.71,21.59 R1.1 | v5.21,34.16 4.83,33.78 4.83,33.02 4.83,32.26 3.05,30.48 1.27,28.7 0.89,28.32 0.89,26.67 0.89,17.02 1.65,16.26 3.94,16.26 4.06,16.26
  Bottom 0.203: v5.21,34.16 6.1,35.05 19.68,35.05 21.59,33.15 JP4.2
RXD0  (via drill 0.38)
  Top 0.203: IC1.21 20.67,14.76 20.83,14.61 20.83,13.46 v21.59,12.7 | JP4.4 16.51,34.04 17.53,35.05 21.72,35.05 21.97,35.05 27.94,35.05 30.99,32 32.51,30.48 33.27,30.48 33.91,30.48 35.05,29.34 35.05,28.07 35.05,27.94 35.05,27.43 35.05,12.19 35.05,12.06 35.05,10.41 33.02,8.38 v27.81,8.38
  Bottom 0.203: v21.59,12.7 21.59,11.81 20.83,11.05 20.19,11.05 19.94,10.79 19.94,9.53 20.07,9.4 20.45,9.4 20.57,9.27 20.83,9.02 20.83,7.37 21.21,6.99 21.46,6.99 23.11,6.99 24.41,8.28 U8.2 26.04,8.38 v27.81,8.38
RXD1  (via drill 0.38)
  Top 0.203: v31.62,22.35 30.99,22.35 U7.4 | IC1.34 17.22,23.44 18.16,24.38 v19.68,24.38
  Bottom 0.203: v31.62,22.35 31.24,22.35 30.23,23.37 29.59,23.37 29.59,26.04 29.46,26.16 27.18,26.16 26.67,26.16 25.91,25.4 24.89,24.38 23.37,24.38 v19.68,24.38
SCK  (via drill 0.38)
  Top 0.203: IC1.27 19.59,17.78 v22.1,17.78
  Bottom 0.203: U3.5 23.4,20.86 23.37,20.83 22.86,20.32 22.73,20.19 22.61,20.07 22.61,18.67 22.61,18.29 v22.1,17.78
SCL  (via drill 0.38)
  Top 0.203: JP5.2 13.97,3.94 14.61,4.57 16.89,4.57 17.78,5.46 R11.1 | U5.1 v23.75,12.71 v23.75,12.7 24.13,12.7 26.8,12.7 29.34,15.24 29.34,15.37 29.34,18.41 27.69,20.07 27.56,20.07 26.42,20.07 26.15,20.33 U6.23 | IC1.22 20.93,15.26 21.21,14.99 21.59,14.61 v21.59,13.97 | v18.67,7.87 18.67,8.38 20.45,10.16 v20.7,10.16 21.84,10.16 U4.14
  Bottom 0.203: 23.3,12.26 21.21,10.16 v20.7,10.16 | 23.3,12.26 v23.75,12.7 | 23.3,12.26 23.24,12.32 v21.59,13.97 | v18.67,7.87 18.67,5.97 17.02,4.32 16.76,4.06 15.88,4.06 15.49,4.06 JP5.2
SDA  (via drill 0.38)
  Top 0.203: 23.37,13.46 22.13,12.22 U4.13 21.97,11.56 20.45,11.56 20.32,11.43 19.68,10.79 19.68,10.41 19.68,9.91 18.8,9.02 18.41,8.64 17.02,8.64 v16.51,9.14 | 23.52,13.61 U5.20 22.84,14.24 v22.61,14.48 | R12.1 JP5.1 | IC1.26 20.71,17.26 21.84,16.13 v21.84,16 | U6.24 26.8,20.57 27.81,20.57 29.08,19.3 30.1,18.29 30.1,18.16 30.1,15.11 30.1,14.86 28.32,13.08 v28.19,13.08
  Top 0.254: 23.37,13.46 23.52,13.61
  Bottom 0.203: v28.19,13.08 25.53,13.08 24,14.61 22.99,14.61 v22.61,14.48 21.84,15.24 v21.84,16 | JP5.1 12.32,3.43 14.35,5.46 14.48,5.59 14.48,6.6 16.51,8.64 v16.51,9.14
TXD0  (via drill 0.38)
  Top 0.203: IC1.19 18.33,13.76 18.24,13.76 v18.16,13.84
  Bottom 0.203: v18.16,13.84 18.16,11.81 18.54,11.81 19.43,10.92 19.43,9.4 19.56,9.27 19.68,9.14 19.81,9.02 19.94,8.89 20.19,8.89 20.32,8.89 20.45,8.76 20.45,7.11 21.46,6.1 21.59,5.97 22.23,5.33 22.48,5.33 23.5,5.33 23.55,5.28 U8.3 24,4.83 25.02,4.83 26.42,3.43 28.32,3.43 28.57,3.43 29.34,4.19 30.1,4.95 32.38,4.95 34.8,4.95 35.05,5.21 35.05,5.33 35.05,10.29 35.05,10.54 35.05,10.67 35.05,27.81 35.05,27.94 27.94,35.05 24.26,35.05 22.86,33.66 22.86,32.51 22.1,31.75 21.08,31.75 20.19,32.64 20.07,32.77 19.81,33.02 JP4.3
TXD1  (via drill 0.38)
  Top 0.203: v33.02,25.15 33.02,24.38 32,23.37 30.99,23.37 U7.3 | IC1.33 17.78,22.48 18.8,22.48 19.05,22.48 21.72,25.15 v21.84,25.15
  Bottom 0.203: v33.02,25.15 33.02,26.29 30.86,28.45 30.73,28.45 27.05,28.45 26.67,28.07 26.67,27.56 26.67,26.67 26.04,26.04 25.15,25.15 v21.84,25.15
VBAT  (via drill 0.38)
  Top 0.203: S1.2 10.51,26.29 6.99,26.29 v5.84,25.15
  Bottom 0.203: 8.54,24.13 8.64,24.13 | 8.54,24.13 JP2.2 | 4.83,24.13 3.43,24.13 JP3.2 1.91,23.88 0.89,24.89 0.89,26.16 0.89,29.72 1.65,30.48 3.81,30.48 TP1.P$1 | 4.83,24.13 8.54,24.13 | 4.83,24.13 v5.84,25.15
VCC  (via drill 0.38)
  Top 0.203: U1.5 19.08,29.82 18.41,30.48 18.41,30.99 18.16,31.24 15.49,31.24 15.43,31.3 | C15.+ 22.86,6.98 22.86,6.99 22.13,7.71 U4.1 | C16.A 28.07,6.73 27.94,6.6 | 26.23,9.21 U4.7 | 26.23,9.21 26.16,9.14 26.13,9.11 U4.6 26.13,7.65 26.13,7.53 26.16,7.49 26.93,6.73 C16.A | 27.94,9.53 C14.1 | JP4.6 12.7,31.75 14.99,31.75 15.11,31.75 15.24,31.75 | IC1.23 21.07,15.76 21.59,15.24 22.73,15.24 | 22.73,15.24 23.24,15.24 U5.18 24,15.24 24.13,15.11 24.13,14.99 24.38,14.73 25.65,14.73 v25.91,14.73 | IC1.51 7.03,19.26 6.86,19.43 6.86,19.56 6.86,20.07 6.99,20.19 | 7.11,20.26 7.05,20.26 6.99,20.19 | 7.11,20.26 IC1.49 12.01,20.26 12.06,20.32 12.51,20.77 12.7,20.95 12.74,20.95 | IC1.43 12.72,20.98 12.74,20.95 | C15.+ 23.11,6.98 23.11,6.99 22.73,6.6 19.05,6.6 18.65,7 R11.2 17.78,6.99 17.78,7.62 17.27,8.13 13.59,8.13 13.22,8.5 | C15.+ 23.06,6.91 23.11,6.86 23.11,5.59 22.35,4.83 20.32,4.83 19.05,3.56 19.05,2.67 JP5.4 20.32,1.27 28.19,1.27 29.08,1.27 30.1,2.29 30.1,2.41 30.1,3.56 30.1,4.57 C16.A | v30.35,19.94 30.35,20.95 U7.5 30.99,21.34 32,21.34 33.15,22.48 33.78,23.11 33.78,28.57 32.89,29.46 | C20.1 27.3,26.67 26.15,25.52 U6.8 | 13.22,8.5 IC1.7 13.22,12.43 13.08,12.57 v12.45,13.21 12.39,13.26 IC1.63 | R12.2 7.49,2.54 v7.11,2.92 | 13.22,8.5 13.21,8.51 v12.32,8.51 | C14.1 28.56,9.51 29.21,10.16 29.21,11.3 v29.21,11.43 | 27.94,9.53 C14.1 | 26.23,9.21 27.63,9.21 27.94,9.53 | U6.13 23.11,24.13 21.34,24.13 19.3,22.1 18.92,21.72 v18.54,21.72 18.54,21.59 17.91,20.95 17.78,20.95 13.08,20.95 12.74,20.95 | 15.43,31.3 v15.37,31.24 | 6.99,20.19 7,20.21 | U5.16 22.97,16.24 22.73,16 22.73,15.24 | 7.11,20.26 7.11,20.32 7,20.43 R1.2
  Top 0.203: v17.78,34.16 18.16,34.54 18.54,34.54 26.67,34.54 26.8,34.54 27.05,34.29 27.18,34.16 27.32,34.02 27.32,33.16 27.3,33.15 27.32,33.13 R10.2 29.34,33.02 32.89,29.46 | 15.43,31.3 15.24,31.5 15.24,31.75 | v15.24,34.16 15.24,31.75 | 32.89,29.46 29.21,29.46 29.08,29.46 28.45,29.46 27.29,28.31 C21.1
  Top 0.254: 18.41,30.48 C5.1 | C20.1 27.29,26.78 27.3,26.8 27.29,26.81 C21.1
  Bottom 0.203: U3.4 30.17,19.76 v30.35,19.94 29.72,19.3 29.72,16 29.72,15.24 | v7.11,2.92 7.11,4.45 9.14,6.48 10.29,6.48 v12.32,8.51 | Q1.2 13.72,13.77 13.72,13.72 13.72,13.57 | 13.72,13.57 R5.2 | 13.72,13.57 12.81,13.57 v12.45,13.21 | v15.37,31.24 15.37,29.46 14.99,29.08 14.86,28.96 14.86,28.19 14.86,25.53 15.62,24.77 16,24.77 16.51,24.26 17.02,23.75 17.02,23.37 17.02,22.1 17.4,21.72 v18.54,21.72 | 29.72,15.24 29.72,15.11 29.72,11.94 v29.21,11.43 | 29.72,15.24 29.59,15.24 29.08,14.73 v25.91,14.73 | v17.78,34.16 17.4,34.54 16.26,34.54 15.88,34.54 15.62,34.54 v15.24,34.16
VON  (via drill 0.38)
  Top 0.203: U1.3 15.68,26.99 15.24,27.43 | 15.24,27.43 15.24,27.56 15.24,28.57 15.55,28.89 U1.1 17.34,28.89 v17.78,28.45 | 14.03,25.27 S1.1 14.18,26.38 14.22,26.42 | U2.1 23.56,28.26 v22.61,29.21 | 14.22,26.42 15.24,27.43 | v13.59,26.42 14.22,26.42
  Bottom 0.203: 18.03,28.7 v17.78,28.45 18.03,28.7 | v22.61,29.21 22.35,28.96 20.32,28.96 18.29,28.96 18.16,28.83 18.03,28.7 | C4.1 9.53,22.86 10.79,21.59 C3.A | C3.A | C3.A 11.18,22.1 11.18,24.64 11.81,25.27 12.95,26.42 v13.59,26.42
XB_EN  (via drill 0.38, 0.51)
  Top 0.203: IC1.35 16.72,25.1 v17.02,25.4 | U2.3 25.08,30.16 v26.67,31.75
  Bottom 0.203: v17.02,25.4 20.07,25.4 20.95,25.4 21.59,26.04 22.35,26.04 22.73,25.65 25.02,25.65 25.65,26.29 25.65,27.43 25.65,28.57 26.29,29.21 26.42,29.34 26.42,30.35 26.42,31.5 v26.67,31.75
XB_VCC  (via drill 0.38)
  Top 0.203: U2.5 21.56,27.21 21.56,27.08 21.59,27.05 21.97,26.67 C6.1 22.23,26.67 23.11,27.56 23.24,27.56 23.5,27.56 25.02,27.56 v27.18,29.72
  Bottom 0.203: 27.94,7.11 27.94,6.1 U8.1 | 27.94,7.11 29.59,8.76 30.35,9.53 30.35,10.41 30.35,10.54 30.35,15.11 33.15,17.91 33.78,18.54 33.78,27.43 32.38,28.83 32.26,28.96 31.5,29.72 v27.18,29.72 | C23.A 28.83,6.22 27.94,7.11

### Text on the board
Bottom: 9/21/10
tPlace: 3.3V | GND | Rx | Tx | RST | BSL | XBEE | STAT | Off | On | EM-408 | Ultimate IMU | SDA | SCL | GND | 3.3V
bPlace: GND | Vin | USB